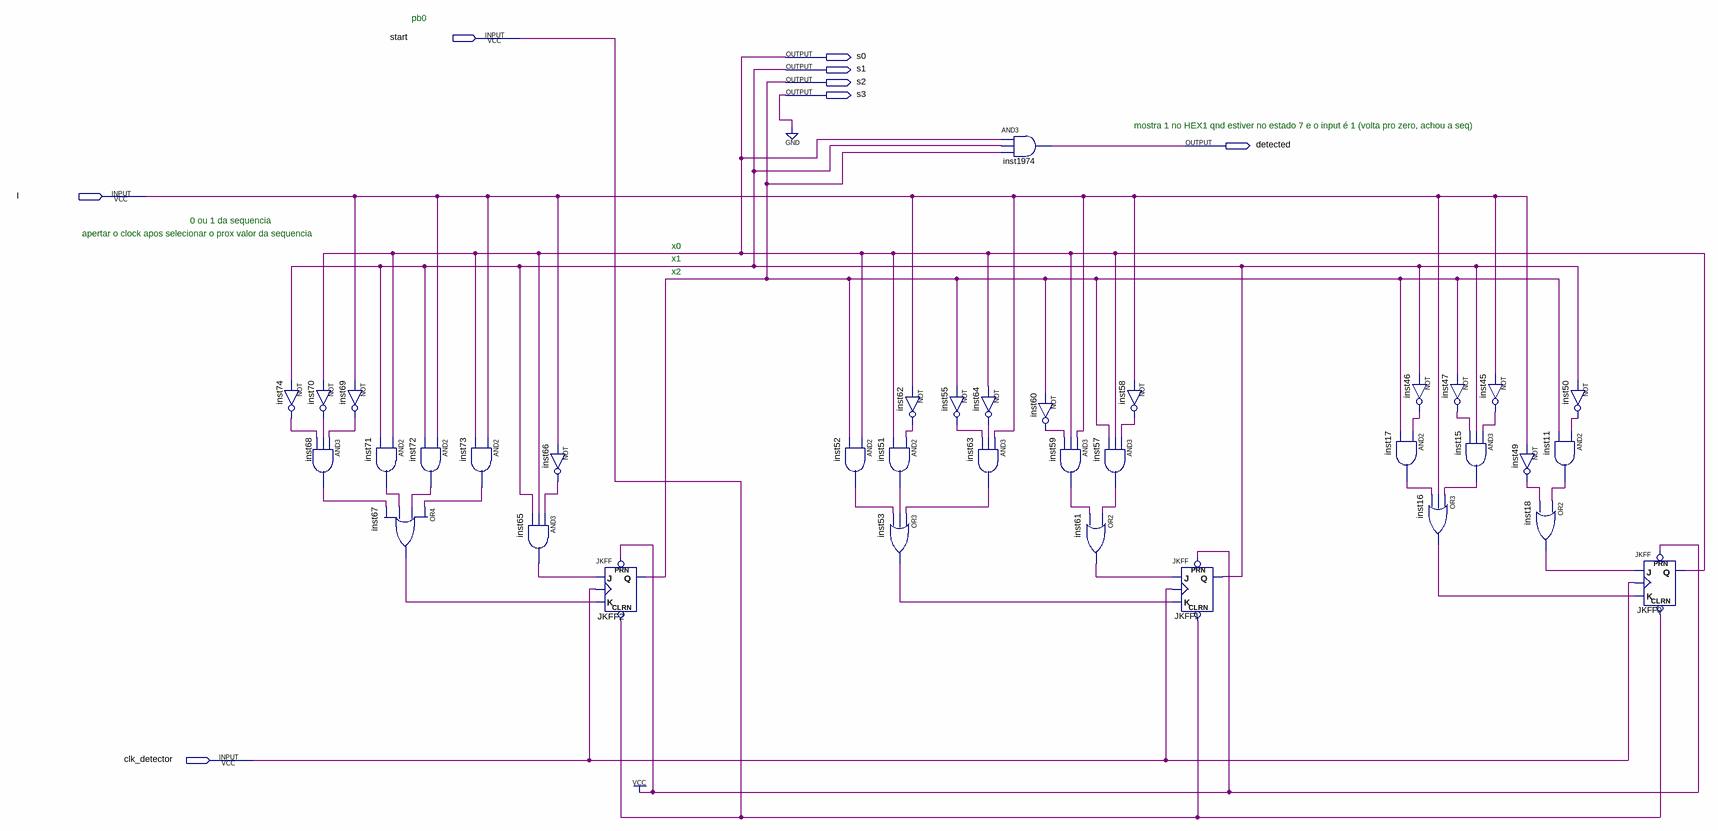
[diagram p0: schematic sheet]
// Quartus schematic detector.bdf as structural Verilog: 36 symbols, 8 pins
module detector (
  input  start,
  input  I,
  input  clk_detector,
  output s0,
  output s1,
  output s2,
  output s3,
  output detected
);

  wire inst11_out, inst15_out, inst16_out, inst17_out, inst18_out, inst45_out, inst46_out, inst47_out,
       inst49_out, inst50_out, inst51_out, inst52_out, inst53_out, inst55_out, inst57_out, inst58_out,
       inst59_out, inst60_out, inst61_out, inst62_out, inst63_out, inst64_out, inst65_out, inst66_out,
       inst67_out, inst68_out, inst69_out, inst70_out, inst71_out, inst72_out, inst73_out, inst74_out;

  not inst74 (inst74_out, s1);
  and inst68 (inst68_out, inst69_out, inst70_out, inst74_out);
  not inst69 (inst69_out, I);
  not inst70 (inst70_out, s0);
  and inst71 (inst71_out, s0, s1);
  or inst67 (inst67_out, inst73_out, inst72_out, inst71_out, inst68_out);
  and inst72 (inst72_out, I, s1);
  and inst73 (inst73_out, I, s0);
  not inst66 (inst66_out, I);
  and inst65 (inst65_out, inst66_out, s0, s1);
  JKFF JKFF2 (.PRN(1'b1), .CLRN(start), .K(inst67_out), .J(inst65_out), .CLK(clk_detector), .Q(s2));
  and inst52 (inst52_out, s0, s2);
  not inst62 (inst62_out, I);
  and inst51 (inst51_out, inst62_out, s0);
  or inst53 (inst53_out, inst63_out, inst51_out, inst52_out);
  not inst55 (inst55_out, s2);
  and inst1974 (detected, s0, s1, s2);
  not inst64 (inst64_out, s0);
  and inst63 (inst63_out, I, inst64_out, inst55_out);
  not inst60 (inst60_out, s2);
  and inst59 (inst59_out, I, s0, inst60_out);
  and inst57 (inst57_out, inst58_out, s0, s2);
  or inst61 (inst61_out, inst57_out, inst59_out);
  not inst58 (inst58_out, I);
  JKFF JKFF1 (.PRN(1'b1), .CLRN(start), .K(inst53_out), .J(inst61_out), .CLK(clk_detector), .Q(s1));
  not inst46 (inst46_out, s1);
  and inst17 (inst17_out, inst46_out, s2);
  or inst16 (inst16_out, inst15_out, I, inst17_out);
  not inst47 (inst47_out, s2);
  and inst15 (inst15_out, inst45_out, s1, inst47_out);
  not inst45 (inst45_out, I);
  not inst49 (inst49_out, I);
  not inst50 (inst50_out, s1);
  and inst11 (inst11_out, inst50_out, s2);
  or inst18 (inst18_out, inst11_out, inst49_out);
  JKFF JKFF0 (.PRN(1'b1), .CLRN(start), .K(inst16_out), .J(inst18_out), .CLK(clk_detector), .Q(s0));

  assign s3 = 1'b0;

  // Notes on the sheet:
  //   pb0
  //   mostra 1 no HEX1 qnd estiver no estado 7 e o input é 1 (volta pro zero, achou a seq)
  //   0 ou 1 da sequencia
  //   apertar o clock apos selecionar o prox valor da sequencia
  //   x0
  //   x1
  //   x2
endmodule
